# Altium project Orient.PrjPcb (part 5 of 6)

## Sheet Power_Regulation1.SchDoc
size A
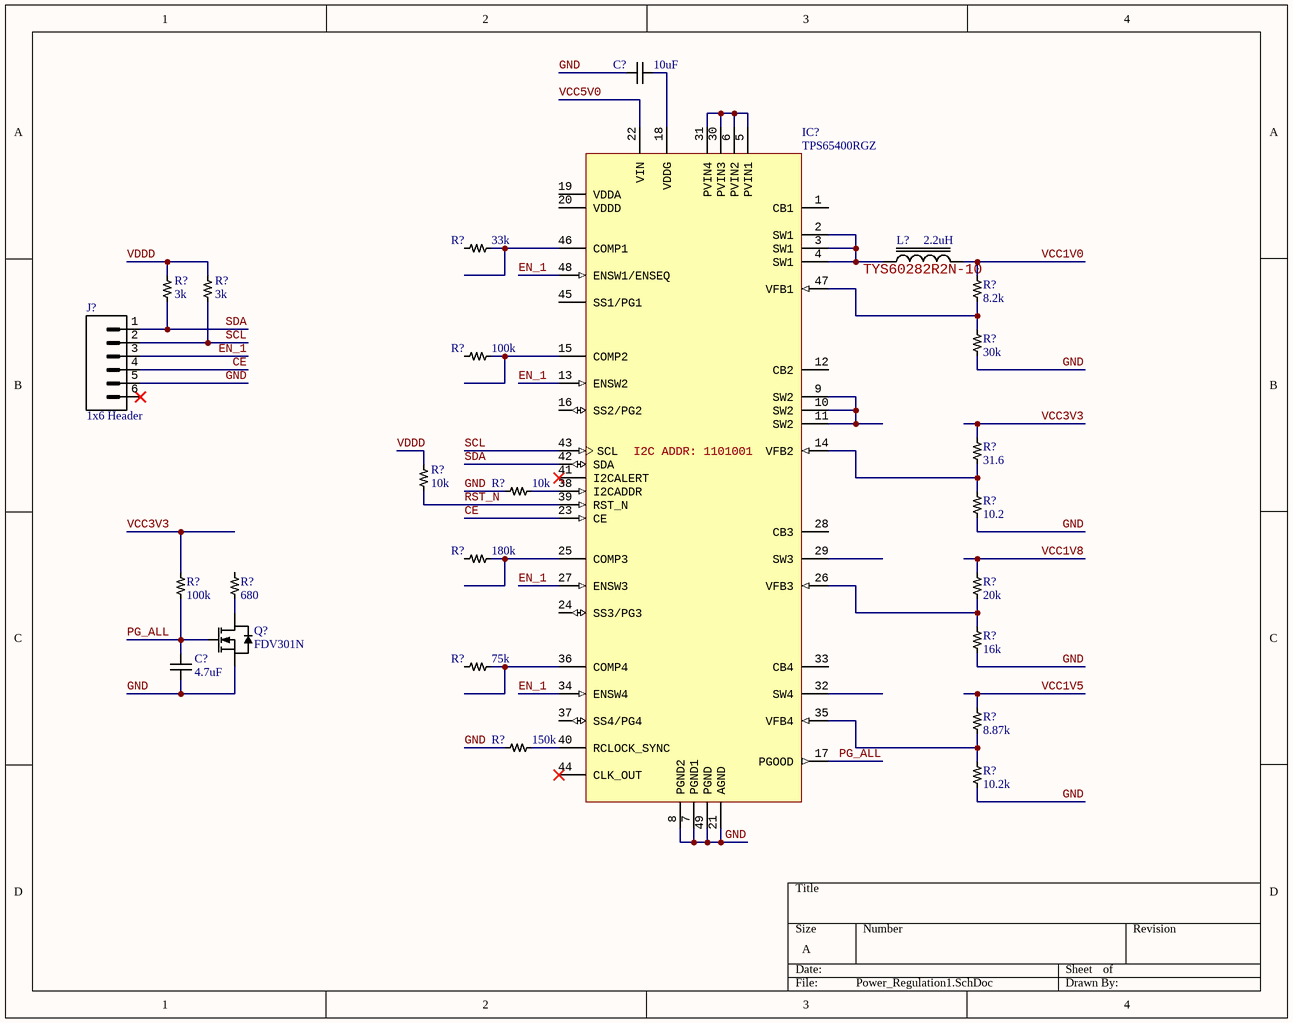
[diagram p9: Power_Regulation1.SchDoc]

### Parts
(Parts that share a designator on the sheet are numbered #1, #2 ... from top to bottom, then left to right.)
C?#91  10uF  [CAP0805]
C?#92  4.7uF  [CAP0805]
IC?#14  TPS65400RGZ  [QFN48]
J?#11  1x6 Header
L?  2.2uH
Q?#2  FDV301N  [SOT-23]
R?#137  33k  [RES0402]
R?#138  3k  [RES0402]
R?#139  3k  [RES0402]
R?#140  8.2k  [RES0402]
R?#141  30k  [RES0402]
R?#142  100k  [RES0402]
R?#143  31.6  [RES0402]
R?#144  10k  [RES0402]
R?#145  10k  [RES0402]
R?#146  10.2  [RES0402]
R?#147  180k  [RES0402]
R?#148  100k  [RES0402]
R?#149  680  [RES0402]
R?#150  20k  [RES0402]
R?#151  16k  [RES0402]
R?#152  75k  [RES0402]
R?#153  8.87k  [RES0402]
R?#154  150k  [RES0402]
R?#155  10.2k  [RES0402]

### Nets
GND: C?#91.2 C?#92.2 IC?#14.7(PGND1) IC?#14.8(PGND2) IC?#14.21(AGND) IC?#14.49(PGND) J?#11.5 Q?#2.2(S) R?#141.1 R?#145.1 R?#146.1 R?#151.1 R?#154.1 R?#155.1
CE: IC?#14.23(CE) J?#11.4
EN_1: IC?#14.13(ENSW2) IC?#14.27(ENSW3) IC?#14.34(ENSW4) IC?#14.48(ENSW1/ENSEQ) J?#11.3
PG_ALL: C?#92.1 IC?#14.17(PGOOD) Q?#2.1(G) R?#148.1
RST_N: IC?#14.39(RST_N) R?#144.1
SCL: IC?#14.43(SCL) J?#11.2 R?#139.1
SDA: IC?#14.42(SDA) J?#11.1 R?#138.1
VCC1V0: L?.2 R?#140.2
VCC1V5: R?#153.2
VCC1V8: R?#150.2
VCC3V3: R?#143.2 R?#148.2
VCC5V0: IC?#14.22(VIN)
VDDD: R?#138.2 R?#139.2 R?#144.2
NetC?#91_1: C?#91.1 IC?#14.18(VDDG)
NetIC?#14_2: IC?#14.2(SW1) IC?#14.3(SW1) IC?#14.4(SW1) L?.1
NetIC?#14_5: IC?#14.5(PVIN1) IC?#14.6(PVIN2) IC?#14.30(PVIN3) IC?#14.31(PVIN4)
NetIC?#14_9: IC?#14.9(SW2) IC?#14.10(SW2) IC?#14.11(SW2)
NetIC?#14_14: IC?#14.14(VFB2) R?#143.1 R?#146.2
NetIC?#14_15: IC?#14.15(COMP2) R?#142.2
NetIC?#14_25: IC?#14.25(COMP3) R?#147.2
NetIC?#14_26: IC?#14.26(VFB3) R?#150.1 R?#151.2
NetIC?#14_35: IC?#14.35(VFB4) R?#153.1 R?#155.2
NetIC?#14_36: IC?#14.36(COMP4) R?#152.2
NetIC?#14_38: IC?#14.38(I2CADDR) R?#145.2
NetIC?#14_40: IC?#14.40(RCLOCK_SYNC) R?#154.2
NetIC?#14_46: IC?#14.46(COMP1) R?#137.2
NetIC?#14_47: IC?#14.47(VFB1) R?#140.1 R?#141.2
NetQ?#2_3: Q?#2.3(D) R?#149.1

Not connected (* = marked no-connect by the designer): IC?#14 1(CB1) 12(CB2) 16(SS2/PG2) 19(VDDA) 20(VDDD) 24(SS3/PG3) 28(CB3) 29(SW3) 32(SW4) 33(CB4) 37(SS4/PG4) 41(I2CALERT)* 44(CLK_OUT)* 45(SS1/PG1); J?#11 6*; R?#137 1; R?#142 1; R?#147 1; R?#149 2; R?#152 1

### Notes on the sheet
- (in symbol TPS65400RGZ) I2C ADDR: 1101001

### Library data of the parts
C?#91 = 08056D106KAT2A: MLCC 10uF 0805 SMD; Manufacturer: Kyocera AVX; Dielectric Material: Ceramic; Voltage Rating: 6.3V; Tolerance: 10%; Dielectric: X5R; Insulation Resistance: 500MR; Supplier 1: Digi-Key; Manufacturer Part Number: 08056D106KAT2A; Stock 1: 217962; Pricing 1: 1=0.50000, 10=0.35100, 100=0.23100, 500=0.17112, 1000=0.14545 (USD); RoHS: Yes; Mount: Surface Mount,PCB; Case/Package: 0805; Number of Pins: 2; Case Code (Imperial): 0805; Case Code (Metric): 2012; Min Operating Temperature: -55°C; Max Operating Temperature: 85°C; Capacitance: 10uF; Package Quantity: 1; Voltage Rating (DC): 6.3V; Packaging: Tape and Reel; Termination: SMD/SMT; Voltage: 6.3V; Length: 2.01mm; Height: 1.4mm; Width: 1.25mm; Thickness: 0.055inch; Depth: 1.25mm; Radiation Hardening: No; REACH SVHC: No SVHC; Lead Free: Lead Free; ComponentLink1URL: https://datasheet.ciiva.com/11788/0900766b80def1a5-11788549.pdf?src-supplier=RSComponents; ComponentLink1Description: https://datasheet.ciiva.com/11788/0900766b80def1a5-11788549.pdf?src-supplier=RSComponents; ComponentLink2URL: https://datasheet.ciiva.com/19467/2012662-19467718.pdf?src-supplier=Jameco; ComponentLink2Description: https://datasheet.ciiva.com/19467/2012662-19467718.pdf?src-supplier=Jameco; ComponentLink3URL: https://datasheet.ciiva.com/151/cx5r-151672.pdf?src-supplier=Digi-Key; ComponentLink3Description: https://datasheet.ciiva.com/151/cx5r-151672.pdf?src-supplier=Digi-Key; ComponentLink4URL: https://datasheet.ciiva.com/7812/26587-7812184.pdf?src-supplier=Element14; ComponentLink4Description: https://datasheet.ciiva.com/7812/26587-7812184.pdf?src-supplier=Element14; ComponentLink5URL: https://datasheet.ciiva.com/14598/70001028-14598616.pdf?src-supplier=Allied+Electronics; ComponentLink5Description: https://datasheet.ciiva.com/14598/70001028-14598616.pdf?src-supplier=Allied+Electronics; ComponentLink6URL: https://datasheet.ciiva.com/151/cx5r-151673.pdf?src-supplier=Digi-Key; ComponentLink6Description: https://datasheet.ciiva.com/151/cx5r-151673.pdf?src-supplier=Digi-Key; ComponentLink7URL: https://datasheet.ciiva.com/7812/26587-7812185.pdf?src-supplier=Element14; ComponentLink7Description: https://datasheet.ciiva.com/7812/26587-7812185.pdf?src-supplier=Element14; ComponentLink8URL: https://datasheet.ciiva.com/151/cx5r-151674.pdf?src-supplier=Digi-Key; ComponentLink8Description: https://datasheet.ciiva.com/151/cx5r-151674.pdf?src-supplier=Digi-Key; ComponentLink9URL: https://datasheet.ciiva.com/7812/1666675-7812186.pdf?src-supplier=Element14; ComponentLink9Description: https://datasheet.ciiva.com/7812/1666675-7812186.pdf?src-supplier=Element14; ComponentLink10URL: https://datasheet.ciiva.com/2988/cx5r-2988044.pdf?src-supplier=Avnet; ComponentLink10Description: https://datasheet.ciiva.com/2988/cx5r-2988044.pdf?src-supplier=Avnet; ComponentLink11URL: https://datasheet.ciiva.com/16392/cx5r-16392797.pdf?src-supplier=Future+Electronics; ComponentLink11Description: https://datasheet.ciiva.com/16392/cx5r-16392797.pdf?src-supplier=Future+Electronics; ComponentLink12URL: https://datasheet.ciiva.com/16544/cx5r-16544062.pdf?src-supplier=Avnet+Asia; ComponentLink12Description: https://datasheet.ciiva.com/16544/cx5r-16544062.pdf?src-supplier=Avnet+Asia
C?#92 = C2012X7R1A475K085AC: MLCC 4.7uF 0805 SMD; Manufacturer: TDK; Dielectric Material: Ceramic; Tolerance: 10%; Voltage Rating: 10V; Dielectric: X7R; Supplier 1: Digi-Key; Manufacturer Part Number: C2012X7R1A475K085AC; Stock 1: 87407; Pricing 1: 1=0.22000, 10=0.15200, 100=0.08600, 500=0.06072, 1000=0.05313 (USD); RoHS: Yes; Mount: Surface Mount; Case/Package: 0805; Case Code (Metric): 2012; Case Code (Imperial): 0805; Min Operating Temperature: -55°C; Max Operating Temperature: 125°C; Package Quantity: 4000; Packaging: Cut Tape; Capacitance: 4.7uF; Voltage Rating (DC): 10V; Length: 0.079inch; Width: 0.049inch; Thickness: 0.039inch; REACH SVHC: No SVHC; Lead Free: Lead Free; ComponentLink1URL: https://datasheet.ciiva.com/14886/tdkmlcccaprange-14886121.pdf?src-supplier=Digi-Key; ComponentLink1Description: https://datasheet.ciiva.com/14886/tdkmlcccaprange-14886121.pdf?src-supplier=Digi-Key; ComponentLink2Description: https://product.tdk.com/info/en/catalog/datasheets/mlcc_commercial_general_en.pdf; ComponentLink2URL: https://product.tdk.com/info/en/catalog/datasheets/mlcc_commercial_general_en.pdf
IC?#14 = TPS65400RGZ: Flexible Power Management Unit with PMBus/I2C Interface, 4.5 to 18 V, -40 to 85 degC, 48-Pin VQFN (RGZ), Green (RoHS & no Sb/Br), Tape and Reel; Output Voltage: 0.6V; Pd - Power Dissipation: 4.5W; Topology: Buck; Input Voltage MIN: 4.5V; Operating Supply Current: 6.3mA; Switching Frequency: 2.2MHz; Brand: TexasInstruments; Input Voltage MAX: 18V; Number of Outputs: 4Output; Load Regulation: 0.1%/A; Output Current: 4A; Unit Weight: 0.004938oz; Input Voltage: 4.5Vto18V; RoHS: True; Datasheet URL: http://www.ti.com/lit/ds/symlink/tps65400.pdf; Height: 1mm; Package Description: 48-Pin Plastic Quad Flat No-lead Package, Body 7 x 7 mm, Pitch 0.5mm, Thermal Pad 4.08 x 4.08 mm; Product: SwitchingRegulators; Packaging: Reel; Operating Temperature Range: -40Cto+85C; Mounting Style: SMD/SMT; Maximum Operating Temperature: +85C; Minimum Operating Temperature: -40C; Length: 7.15mm; Factory Pack Quantity: 250; Width: 7.15mm; Package Reference: RGZ0048B; Mounting Technology: SurfaceMount; Datasheet Version: Rev. B, 09/2015; Manufacturer: TexasInstruments; Manufacturer URL: http://www.ti.com/; Type: SwitchingRegulator; Series: TPS65400; Shutdown: Shutdown; Product Category: VoltageRegulators-SwitchingRegulators; Package / Case: VQFN-48
J?#11 = PPTC061LFBN-RC: Header Female 1x6 2.54mm; Manufacturer: Sullins; Number of Positions: 6; Connector Type: Header,Socket; Pitch: 0.1inch; Supplier 1: Digi-Key; Manufacturer Part Number: PPTC061LFBN-RC; Stock 1: 13781; Pricing 1: 1=0.52000, 10=0.48300, 100=0.37050, 500=0.32220, 1000=0.26582, 5000=0.23360, 10000=0.23270 (USD); RoHS: Yes; Mount: Through Hole; Color: Black; Contact Plating: Tin; Contact Material: Bronze; Housing Material: Plastic; Package Quantity: 1000; Number of Rows: 1; Packaging: Bulk; Termination: Solder; Length: 15.7mm; Height: 8.5mm; Width: 2.5mm; Lead Free: Lead Free; ComponentLink1URL: https://media.digikey.com/pdf/Data%20Sheets/Sullins%20PDFs/Female_Headers.100_DS.pdf?src-supplier=Digi-Key; ComponentLink1Description: https://media.digikey.com/pdf/Data%20Sheets/Sullins%20PDFs/Female_Headers.100_DS.pdf?src-supplier=Digi-Key; ComponentLink2URL: http://www.sullinscorp.com/catalogs/78_Page80-81_HEADER_.100_2.54mm_FEMALE.pdf?src-supplier=Future+Electronics; ComponentLink2Description: http://www.sullinscorp.com/catalogs/78_Page80-81_HEADER_.100_2.54mm_FEMALE.pdf?src-supplier=Future+Electronics
L? = TYS60282R2N-10: Inductor 2.2uH; Manufacturer: Laird Steward; Tolerance: 30%; Current Rating: 3.75A; Saturation Current: 5.1A; Shielding: Shielded; DC Resistance (DCR): 20mR; Self Resonant Frequency: 48MHz; Test Frequency: 100kHz; Supplier 1: Digi-Key; Manufacturer Part Number: TYS60282R2N-10; Stock 1: 7309; Pricing 1: 1=0.67000, 10=0.58700, 100=0.41940, 500=0.35226, 1000=0.28516 (USD); RoHS: Yes; Mount: Surface Mount; Case/Package: Nonstandard; Min Operating Temperature: -40°C; Max Operating Temperature: 125°C; Package Quantity: 2000; Packaging: Tape and Reel; Inductance: 2.2uH; Max DC Current: 3.75A; Termination: SMD/SMT; Length: 0.236inch; Height: 2.8mm; Width: 0.236inch; Height - Seated (Max): 0.118inch; ComponentLink1URL: http://www.mouser.com/ds/2/223/SIP-DS-TYS%206028%200413-558563.pdf?src-supplier=Mouser; ComponentLink1Description: http://www.mouser.com/ds/2/223/SIP-DS-TYS%206028%200413-558563.pdf?src-supplier=Mouser; ComponentLink3URL: https://assets.lairdtech.com/home/brandworld/files/Catalog_Power%20Inductor%20TYS%20SERIES%200617.pdf?src-supplier=Digi-Key; ComponentLink3Description: https://assets.lairdtech.com/home/brandworld/files/Catalog_Power%20Inductor%20TYS%20SERIES%200617.pdf?src-supplier=Digi-Key
Q?#2 = FDV301N: Digital FET, N-Channel, 0.35 W, 25 V, -55 to 150 degC, 3-Pin SOT23, RoHS, Tape and Reel; Manufacturer: Fairchild; Rds(on) Test Voltage Vgs: 2.7V; Threshold Voltage Vgs Typ: 850mV; Voltage Vds Typ: 25V; Reel Quantity: 3000; Voltage Vgs Rds on Measurement: 4.5V; Power Dissipation Pd: 350mW; Continuous Drain Current Id: 220mA; Transistor Polarity: NChannel; No. of Transistors: 1; Package Version: Rev. 12, 03/2016; Voltage Vgs th Max: 1.5V; ESD HBM: 6kV; Pulse Current Idm: 500mA; Current Temperature: 25degC; On Resistance Rds(on): 5ohm; External Depth: 2.5mm; SMD Marking: 301; No. of Pins: 3; External Width: 3.05mm; SVHC: NoSVHC(19-Dec-2012); External Length / Height: 1.12mm; Termination Type: SMD; Transistor Case Style: SOT-23; Package Reference: SOT23-3; Package URL: http://www.fairchildsemi.com/dwg/MA/MA03D.pdf; Voltage Vgs Max: 850mV; Drain Source Voltage Vds: 25V; Operating Temperature Max: 150degC; Package Description: 3-Pin Small Outline Transistor, Body 2.92 x 1.325 mm, Pitch 0.95 mm; Operating Temperature Min: -55degC; Datasheet Version: Jun-09; Tape Width: 8mm; Full Power Rating Temperature: 25degC; Datasheet URL: https://datasheet.ciiva.com/8114/fdv301n-8114688.pdf; Package / Case: SOT-23; Manufacturer URL: https://www.fairchildsemi.com/; Current Id Max: 220mA; Operating Temperature Range: -55degCto+150degC
R?#137 = RC0402FR-0733KL: Resistor 33kOhm 0402 SMD; Manufacturer: Yageo; Tolerance: 1%; Resistance: 33kR; Power Rating: 63mW; Temperature Coefficient: 100ppm/°C; Voltage Rating: 50V; Supplier 1: Digi-Key; Manufacturer Part Number: RC0402FR-0733KL; Stock 1: 1570814; Pricing 1: 1=0.10000, 10=0.01600, 100=0.00670, 1000=0.00301, 2500=0.00261, 5000=0.00215 (USD); RoHS: Yes; Case/Package: 0402; Number of Pins: 2; Weight: 2.3E-05oz; Case Code (Metric): 1005; Case Code (Imperial): 0402; Min Operating Temperature: -55°C; Max Operating Temperature: 155°C; Packaging: Tape and Reel; Package Quantity: 1; Voltage Rating (DC): 50V; Composition: Thick Film; Number of Terminations: 2; Termination: SMD/SMT; Military Standard: Not; Max Power Dissipation: 63mW; Features: Moisture Resistant; Length: 1mm; Height: 0.016inch; Depth: 0.5mm; Width: 0.5mm; REACH SVHC: No SVHC; Lead Free: Lead Free; ComponentLink1URL: https://datasheet.ciiva.com/2453/pyu-r-int-thick-7-2453448.pdf?src-supplier=Digi-Key; ComponentLink1Description: https://datasheet.ciiva.com/2453/pyu-r-int-thick-7-2453448.pdf?src-supplier=Digi-Key; ComponentLink2URL: https://datasheet.ciiva.com/2453/pyu-r-int-thick-7-2453449.pdf?src-supplier=Digi-Key; ComponentLink2Description: https://datasheet.ciiva.com/2453/pyu-r-int-thick-7-2453449.pdf?src-supplier=Digi-Key; ComponentLink3URL: https://datasheet.ciiva.com/12577/pyu-rc0402-51-rohs-l-6-r-12577273.pdf?src-supplier=Mouser; ComponentLink3Description: https://datasheet.ciiva.com/12577/pyu-rc0402-51-rohs-l-6-r-12577273.pdf?src-supplier=Mouser; ComponentLink4URL: https://datasheet.ciiva.com/2453/pyu-r-int-thick-7-2453450.pdf?src-supplier=Digi-Key; ComponentLink4Description: https://datasheet.ciiva.com/2453/pyu-r-int-thick-7-2453450.pdf?src-supplier=Digi-Key; ComponentLink5URL: https://datasheet.ciiva.com/7849/1018594-7849964.pdf?src-supplier=Element14; ComponentLink5Description: https://datasheet.ciiva.com/7849/1018594-7849964.pdf?src-supplier=Element14; ComponentLink6URL: https://datasheet.ciiva.com/7849/1018594-7849965.pdf?src-supplier=Element14; ComponentLink6Description: https://datasheet.ciiva.com/7849/1018594-7849965.pdf?src-supplier=Element14
R?#138 R?#139 = RC0402FR-073KL: Resistor 3kOhm 0402 SMD; Manufacturer: Yageo; Tolerance: 1%; Resistance: 3kR; Power Rating: 63mW; Voltage Rating: 50V; Temperature Coefficient: 100ppm/°C; Supplier 1: Digi-Key; Manufacturer Part Number: RC0402FR-073KL; Stock 1: 1790568; Pricing 1: 1=0.10000, 10=0.01600, 100=0.00670, 1000=0.00301, 2500=0.00261, 5000=0.00215 (USD); RoHS: Yes; Case/Package: 0402; Case Code (Metric): 1005; Case Code (Imperial): 0402; Min Operating Temperature: -55°C; Max Operating Temperature: 155°C; Package Quantity: 1; Packaging: Tape and Reel; Composition: Thick Film; Number of Terminations: 2; Termination: SMD/SMT; Military Standard: Not; Max Power Dissipation: 63mW; Voltage Rating (DC): 50V; Features: Moisture Resistant; Length: 1mm; Height: 0.016inch; Width: 0.02inch; Depth: 0.5mm; REACH SVHC: Unknown; Lead Free: Lead Free; ComponentLink1URL: https://datasheet.ciiva.com/2553/pyu-r-int-thick-7-2553255.pdf?src-supplier=Digi-Key; ComponentLink1Description: https://datasheet.ciiva.com/2553/pyu-r-int-thick-7-2553255.pdf?src-supplier=Digi-Key; ComponentLink2URL: https://datasheet.ciiva.com/2553/pyu-r-int-thick-7-2553256.pdf?src-supplier=Digi-Key; ComponentLink2Description: https://datasheet.ciiva.com/2553/pyu-r-int-thick-7-2553256.pdf?src-supplier=Digi-Key; ComponentLink3URL: https://datasheet.ciiva.com/7849/1018594-7849992.pdf?src-supplier=Element14; ComponentLink3Description: https://datasheet.ciiva.com/7849/1018594-7849992.pdf?src-supplier=Element14; ComponentLink4URL: https://datasheet.ciiva.com/2553/pyu-r-int-thick-7-2553254.pdf?src-supplier=Digi-Key; ComponentLink4Description: https://datasheet.ciiva.com/2553/pyu-r-int-thick-7-2553254.pdf?src-supplier=Digi-Key; ComponentLink5URL: https://datasheet.ciiva.com/7849/1018594-7849991.pdf?src-supplier=Element14; ComponentLink5Description: https://datasheet.ciiva.com/7849/1018594-7849991.pdf?src-supplier=Element14; ComponentLink6URL: https://datasheet.ciiva.com/12666/pyu-rc0402-51-rohs-l-6-r-12666952.pdf?src-supplier=Mouser; ComponentLink6Description: https://datasheet.ciiva.com/12666/pyu-rc0402-51-rohs-l-6-r-12666952.pdf?src-supplier=Mouser
R?#140 = RC0402FR-078K2L: Resistor 8.2kOhm 0402 SMD; Manufacturer: Yageo; Resistance: 8.2kR; Power Rating: 63mW; Tolerance: 1%; Voltage Rating: 50V; Temperature Coefficient: 100ppm/°C; Supplier 1: Digi-Key; Manufacturer Part Number: RC0402FR-078K2L; Stock 1: 4299157; Pricing 1: 1=0.10000, 10=0.01600, 100=0.00670, 1000=0.00301, 2500=0.00261, 5000=0.00215 (USD); RoHS: Yes; Case/Package: 0402; Weight: 2.3E-05oz; Case Code (Metric): 1005; Case Code (Imperial): 0402; Min Operating Temperature: -55°C; Max Operating Temperature: 155°C; Package Quantity: 1; Packaging: Tape and Reel; Composition: Thick Film; Number of Terminations: 2; Termination: SMD/SMT; Military Standard: Not; Max Power Dissipation: 63mW; Working Voltage: 50V; Features: Moisture Resistant; Length: 1mm; Height: 0.016inch; Width: 0.02inch; Depth: 0.5mm; REACH SVHC: Unknown; Lead Free: Lead Free; ComponentLink1URL: https://datasheet.ciiva.com/2519/pyu-r-int-thick-7-2519060.pdf?src-supplier=Digi-Key; ComponentLink1Description: https://datasheet.ciiva.com/2519/pyu-r-int-thick-7-2519060.pdf?src-supplier=Digi-Key; ComponentLink2URL: https://datasheet.ciiva.com/2519/pyu-r-int-thick-7-2519061.pdf?src-supplier=Digi-Key; ComponentLink2Description: https://datasheet.ciiva.com/2519/pyu-r-int-thick-7-2519061.pdf?src-supplier=Digi-Key; ComponentLink3URL: https://datasheet.ciiva.com/2519/pyu-r-int-thick-7-2519062.pdf?src-supplier=Digi-Key; ComponentLink3Description: https://datasheet.ciiva.com/2519/pyu-r-int-thick-7-2519062.pdf?src-supplier=Digi-Key; ComponentLink4URL: https://datasheet.ciiva.com/12577/pyu-rc0402-51-rohs-l-6-r-12577260.pdf?src-supplier=Mouser; ComponentLink4Description: https://datasheet.ciiva.com/12577/pyu-rc0402-51-rohs-l-6-r-12577260.pdf?src-supplier=Mouser; ComponentLink5URL: https://datasheet.ciiva.com/16741/pyu-rc0402-51-rohs-l-6-r-16741020.pdf?src-supplier=Future+Electronics; ComponentLink5Description: https://datasheet.ciiva.com/16741/pyu-rc0402-51-rohs-l-6-r-16741020.pdf?src-supplier=Future+Electronics; ComponentLink6URL: https://datasheet.ciiva.com/7850/1018594-7850109.pdf?src-supplier=Element14; ComponentLink6Description: https://datasheet.ciiva.com/7850/1018594-7850109.pdf?src-supplier=Element14; ComponentLink7URL: https://datasheet.ciiva.com/15189/getdatasheetpartid-329193-15189517.pdf?src-supplier=Verical; ComponentLink7Description: https://datasheet.ciiva.com/15189/getdatasheetpartid-329193-15189517.pdf?src-supplier=Verical; ComponentLink8URL: https://datasheet.ciiva.com/7850/1018594-7850110.pdf?src-supplier=Element14; ComponentLink8Description: https://datasheet.ciiva.com/7850/1018594-7850110.pdf?src-supplier=Element14
R?#141 = RC0402FR-0730KL: Resistor 30kOhm 0402 SMD; Manufacturer: Yageo; Tolerance: 1%; Resistance: 30kR; Power Rating: 62.5mW; Voltage Rating: 50V; Temperature Coefficient: 100ppm/°C; Supplier 1: Digi-Key; Manufacturer Part Number: RC0402FR-0730KL; Stock 1: 1533780; Pricing 1: 1=0.10000, 10=0.01600, 100=0.00670, 1000=0.00301, 2500=0.00261, 5000=0.00215 (USD); RoHS: Yes; Case/Package: 0402; Weight: 2.3E-05oz; Case Code (Imperial): 0402; Case Code (Metric): 1005; Min Operating Temperature: -55°C; Max Operating Temperature: 155°C; Packaging: Tape and Reel; Termination: SMD/SMT; Composition: Thick Film; Military Standard: Not; Voltage Rating (DC): 50V; Length: 1mm; Height: 0.35mm; Width: 0.5mm; Depth: 0.5mm; REACH SVHC: Unknown; Lead Free: Lead Free; ComponentLink1URL: https://datasheet.ciiva.com/12577/pyu-rc0402-51-rohs-l-6-r-12577743.pdf?src-supplier=Mouser; ComponentLink1Description: https://datasheet.ciiva.com/12577/pyu-rc0402-51-rohs-l-6-r-12577743.pdf?src-supplier=Mouser; ComponentLink2URL: https://datasheet.ciiva.com/7849/1018594-7849957.pdf?src-supplier=Element14; ComponentLink2Description: https://datasheet.ciiva.com/7849/1018594-7849957.pdf?src-supplier=Element14; ComponentLink3URL: https://datasheet.ciiva.com/46394/1018594-46394938.pdf?src-supplier=Element14; ComponentLink3Description: https://datasheet.ciiva.com/46394/1018594-46394938.pdf?src-supplier=Element14
R?#142 R?#148 = RC0402FR-07100KL: Resistor 100kOhm 0402 SMD; Manufacturer: Yageo; Tolerance: 1%; Resistance: 100kR; Temperature Coefficient: 100ppm/°C; Power Rating: 63mW; Voltage Rating: 50V; Supplier 1: Digi-Key; Manufacturer Part Number: RC0402FR-07100KL; Stock 1: 55225580; Pricing 1: 1=0.10000, 10=0.01500, 100=0.00630, 1000=0.00281, 2500=0.00244, 5000=0.00201 (USD); RoHS: Yes; Case/Package: 0402; Case Code (Metric): 1005; Case Code (Imperial): 0402; Min Operating Temperature: -55°C; Max Operating Temperature: 155°C; Composition: Thick Film; Packaging: Tape and Reel; Package Quantity: 1; Number of Terminations: 2; Termination: SMD/SMT; Military Standard: Not; Max Power Dissipation: 63mW; Working Voltage: 50V; Features: Moisture Resistant; Length: 0.039inch; Height: 0.016inch; Width: 0.02inch; Depth: 0.5mm; REACH SVHC: No SVHC; Lead Free: Lead Free; ComponentLink1URL: https://datasheet.ciiva.com/11819/0900766b80c66297-11819452.pdf?src-supplier=RSComponents; ComponentLink1Description: https://datasheet.ciiva.com/11819/0900766b80c66297-11819452.pdf?src-supplier=RSComponents; ComponentLink2URL: https://datasheet.ciiva.com/2453/pyu-r-int-thick-7-2453361.pdf?src-supplier=Digi-Key; ComponentLink2Description: https://datasheet.ciiva.com/2453/pyu-r-int-thick-7-2453361.pdf?src-supplier=Digi-Key; ComponentLink3URL: https://datasheet.ciiva.com/2453/pyu-r-int-thick-7-2453362.pdf?src-supplier=Digi-Key; ComponentLink3Description: https://datasheet.ciiva.com/2453/pyu-r-int-thick-7-2453362.pdf?src-supplier=Digi-Key; ComponentLink4URL: https://datasheet.ciiva.com/2453/pyu-r-int-thick-7-2453363.pdf?src-supplier=Digi-Key; ComponentLink4Description: https://datasheet.ciiva.com/2453/pyu-r-int-thick-7-2453363.pdf?src-supplier=Digi-Key; ComponentLink5URL: https://datasheet.ciiva.com/22747/1018594-22747509.pdf?src-supplier=Element14; ComponentLink5Description: https://datasheet.ciiva.com/22747/1018594-22747509.pdf?src-supplier=Element14; ComponentLink6URL: https://datasheet.ciiva.com/15189/getdatasheetpartid-323696-15189334.pdf?src-supplier=Verical; ComponentLink6Description: https://datasheet.ciiva.com/15189/getdatasheetpartid-323696-15189334.pdf?src-supplier=Verical; ComponentLink7URL: https://datasheet.ciiva.com/12667/pyu-rc0402-51-rohs-l-6-r-12667930.pdf?src-supplier=Mouser; ComponentLink7Description: https://datasheet.ciiva.com/12667/pyu-rc0402-51-rohs-l-6-r-12667930.pdf?src-supplier=Mouser
R?#143 = RC0402FR-0731R6L: POWER Resistor 31.6Ohm 0402 SMD; Manufacturer: Yageo; Power Rating: 62.5mW; Resistance: 31.6R; Tolerance: 1%; Voltage Rating: 50V; Temperature Coefficient: 100ppm/°C; Max Power Dissipation: 63mW; Supplier 1: Digi-Key; Manufacturer Part Number: RC0402FR-0731R6L; Stock 1: 405052; Pricing 1: 1=0.10000, 10=0.01600, 100=0.00670, 1000=0.00301, 2500=0.00261, 5000=0.00215 (USD); RoHS: Yes; Case/Package: 0402; Case Code (Imperial): 0402; Case Code (Metric): 1005; Min Operating Temperature: -55°C; Max Operating Temperature: 155°C; Packaging: Tape and Reel; Composition: Thick Film; Termination: SMD/SMT; Number of Terminations: 2; Military Standard: Not; Voltage Rating (DC): 50V; Features: Moisture Resistant; Length: 1mm; Height: 0.016inch; Width: 0.5mm; Depth: 0.5mm; Lead Free: Lead Free; ComponentLink1URL: https://datasheet.ciiva.com/17423/pyu-rc0402-51-rohs-l-6-r-17423865.pdf?src-supplier=Future+Electronics; ComponentLink1Description: https://datasheet.ciiva.com/17423/pyu-rc0402-51-rohs-l-6-r-17423865.pdf?src-supplier=Future+Electronics
R?#144 R?#145 = RC0402FR-0710KL: Resistor 10kOhm 0402 SMD; Manufacturer: Yageo; Resistance: 10kR; Tolerance: 1%; Temperature Coefficient: 100ppm/°C; Voltage Rating: 50V; Power Rating: 62.5mW; Supplier 1: Digi-Key; Manufacturer Part Number: RC0402FR-0710KL; Stock 1: 78932647; Pricing 1: 1=0.10000, 10=0.01500, 100=0.00630, 1000=0.00281, 2500=0.00244, 5000=0.00201 (USD); RoHS: Yes; Case/Package: 0402; Number of Pins: 2; Case Code (Imperial): 0402; Case Code (Metric): 1005; Min Operating Temperature: -55°C; Max Operating Temperature: 155°C; Packaging: Tape and Reel; Composition: Thick Film; Voltage Rating (DC): 50V; Termination: SMD/SMT; Military Standard: Not; Working Voltage: 50V; Number of Terminations: 2; Length: 1mm; Height: 0.32mm; Width: 0.5mm; Depth: 0.5mm; Lead Pitch: 0.2mm; REACH SVHC: No SVHC; Lead Free: Lead Free; ComponentLink1URL: https://datasheet.ciiva.com/7660/38568-7660787.pdf?src-supplier=Element14; ComponentLink1Description: https://datasheet.ciiva.com/7660/38568-7660787.pdf?src-supplier=Element14; ComponentLink2URL: https://datasheet.ciiva.com/7983/1018594-7983486.pdf?src-supplier=Element14; ComponentLink2Description: https://datasheet.ciiva.com/7983/1018594-7983486.pdf?src-supplier=Element14; ComponentLink3URL: https://datasheet.ciiva.com/7849/1784430-7849813.pdf?src-supplier=Element14; ComponentLink3Description: https://datasheet.ciiva.com/7849/1784430-7849813.pdf?src-supplier=Element14; ComponentLink4URL: https://datasheet.ciiva.com/7849/1686128-7849814.pdf?src-supplier=Element14; ComponentLink4Description: https://datasheet.ciiva.com/7849/1686128-7849814.pdf?src-supplier=Element14; ComponentLink5URL: https://datasheet.ciiva.com/7849/1784430-7849815.pdf?src-supplier=Element14; ComponentLink5Description: https://datasheet.ciiva.com/7849/1784430-7849815.pdf?src-supplier=Element14; ComponentLink6URL: https://datasheet.ciiva.com/22747/1018594-22747512.pdf?src-supplier=Element14; ComponentLink6Description: https://datasheet.ciiva.com/22747/1018594-22747512.pdf?src-supplier=Element14; ComponentLink7URL: https://datasheet.ciiva.com/12667/pyu-rc0402-51-rohs-l-6-r-12667067.pdf?src-supplier=Mouser; ComponentLink7Description: https://datasheet.ciiva.com/12667/pyu-rc0402-51-rohs-l-6-r-12667067.pdf?src-supplier=Mouser
R?#146 = RC0402FR-0710R2L: Resistor 10.2Ohm 0402 SMD; Manufacturer: Yageo; Resistance: 10.2R; Tolerance: 1%; Temperature Coefficient: 100ppm/°C; Power Rating: 62.5mW; Voltage Rating: 50V; Max Power Dissipation: 63mW; Supplier 1: Digi-Key; Manufacturer Part Number: RC0402FR-0710R2L; Stock 1: 15931; Pricing 1: 1=0.10000, 10=0.01600, 100=0.00670, 1000=0.00301, 2500=0.00261, 5000=0.00215 (USD); RoHS: Yes; Case/Package: 0402; Contact Plating: Tin,Matte; Case Code (Imperial): 0402; Case Code (Metric): 1005; Min Operating Temperature: -55°C; Max Operating Temperature: 155°C; Composition: Thick Film; Packaging: Tape and Reel; Termination: SMD/SMT; Number of Terminations: 2; Military Standard: Not; Voltage Rating (DC): 50V; Features: Moisture Resistant; Length: 1mm; Height: 0.016inch; Width: 0.5mm; Depth: 0.5mm; Lead Free: Lead Free; ComponentLink1URL: https://datasheet.ciiva.com/16869/pyu-rc0402-51-rohs-l-6-16869613.pdf?src-supplier=Avnet+Europe; ComponentLink1Description: https://datasheet.ciiva.com/16869/pyu-rc0402-51-rohs-l-6-16869613.pdf?src-supplier=Avnet+Europe; ComponentLink2URL: https://datasheet.ciiva.com/8891/pyu-rc0402-51-rohs-l-6-8891246.pdf?src-supplier=Avnet; ComponentLink2Description: https://datasheet.ciiva.com/8891/pyu-rc0402-51-rohs-l-6-8891246.pdf?src-supplier=Avnet; ComponentLink3URL: https://datasheet.ciiva.com/28405/pyu-rc0402-51-rohs-l-6-28405406.pdf?src-supplier=Avnet+Europe; ComponentLink3Description: https://datasheet.ciiva.com/28405/pyu-rc0402-51-rohs-l-6-28405406.pdf?src-supplier=Avnet+Europe
R?#147 = RC0402FR-07180KL: Resistor 180kOhm 0402 SMD; Manufacturer: Yageo; Tolerance: 1%; Power Rating: 63mW; Temperature Coefficient: 100ppm/°C; Resistance: 180kR; Voltage Rating: 50V; Supplier 1: Digi-Key; Manufacturer Part Number: RC0402FR-07180KL; Stock 1: 2802128; Pricing 1: 1=0.10000, 10=0.01600, 100=0.00670, 1000=0.00301, 2500=0.00261, 5000=0.00215 (USD); RoHS: Yes; Case/Package: Molded; Case Code (Imperial): 0402; Case Code (Metric): 1005; Min Operating Temperature: -55°C; Max Operating Temperature: 155°C; Packaging: Tape and Reel; Termination: SMD/SMT; Military Standard: Not; Composition: Thick Film; Length: 1mm; Depth: 0.5mm; REACH SVHC: Unknown; Lead Free: Lead Free; ComponentLink1URL: https://datasheet.ciiva.com/7983/1018594-7983497.pdf?src-supplier=Element14; ComponentLink1Description: https://datasheet.ciiva.com/7983/1018594-7983497.pdf?src-supplier=Element14; ComponentLink2URL: https://datasheet.ciiva.com/7849/1018594-7849851.pdf?src-supplier=Element14; ComponentLink2Description: https://datasheet.ciiva.com/7849/1018594-7849851.pdf?src-supplier=Element14; ComponentLink3URL: https://datasheet.ciiva.com/7849/1018594-7849852.pdf?src-supplier=Element14; ComponentLink3Description: https://datasheet.ciiva.com/7849/1018594-7849852.pdf?src-supplier=Element14; ComponentLink4URL: https://datasheet.ciiva.com/17025/pyu-rc0402-51-rohs-l-6-r-17025693.pdf?src-supplier=Future+Electronics; ComponentLink4Description: https://datasheet.ciiva.com/17025/pyu-rc0402-51-rohs-l-6-r-17025693.pdf?src-supplier=Future+Electronics; ComponentLink5URL: https://datasheet.ciiva.com/12656/pyu-rc0402-51-rohs-l-6-r-12656911.pdf?src-supplier=Mouser; ComponentLink5Description: https://datasheet.ciiva.com/12656/pyu-rc0402-51-rohs-l-6-r-12656911.pdf?src-supplier=Mouser
R?#149 = RC0402FR-07680RL: Resistor 680Ohm 0402 SMD; Manufacturer: Yageo; Resistance: 680R; Tolerance: 1%; Temperature Coefficient: 100ppm/°C; Power Rating: 63mW; Voltage Rating: 50V; Supplier 1: Digi-Key; Manufacturer Part Number: RC0402FR-07680RL; Stock 1: 1052750; Pricing 1: 1=0.10000, 10=0.01600, 100=0.00670, 1000=0.00301, 2500=0.00261, 5000=0.00215 (USD); RoHS: Yes; Case/Package: 0402; Case Code (Imperial): 0402; Case Code (Metric): 1005; Min Operating Temperature: -55°C; Max Operating Temperature: 155°C; Composition: Thick Film; Packaging: Tape and Reel; Termination: SMD/SMT; Military Standard: Not; Length: 1mm; Depth: 0.5mm; REACH SVHC: No SVHC; Lead Free: Lead Free; ComponentLink1URL: https://datasheet.ciiva.com/7850/1018594-7850070.pdf?src-supplier=Element14; ComponentLink1Description: https://datasheet.ciiva.com/7850/1018594-7850070.pdf?src-supplier=Element14; ComponentLink2URL: https://datasheet.ciiva.com/7850/1018594-7850071.pdf?src-supplier=Element14; ComponentLink2Description: https://datasheet.ciiva.com/7850/1018594-7850071.pdf?src-supplier=Element14; ComponentLink3URL: https://datasheet.ciiva.com/12667/pyu-rc0402-51-rohs-l-6-r-12667916.pdf?src-supplier=Mouser; ComponentLink3Description: https://datasheet.ciiva.com/12667/pyu-rc0402-51-rohs-l-6-r-12667916.pdf?src-supplier=Mouser; ComponentLink4URL: https://datasheet.ciiva.com/17042/pyu-rc0402-51-rohs-l-6-r-17042399.pdf?src-supplier=Future+Electronics; ComponentLink4Description: https://datasheet.ciiva.com/17042/pyu-rc0402-51-rohs-l-6-r-17042399.pdf?src-supplier=Future+Electronics
R?#150 = RC0402FR-0720KL: Resistor 20kOhm 0402 SMD; Manufacturer: Yageo; Tolerance: 1%; Resistance: 20kR; Power Rating: 62.5mW; Voltage Rating: 50V; Temperature Coefficient: 100ppm/°C; Max Power Dissipation: 63mW; Supplier 1: Digi-Key; Manufacturer Part Number: RC0402FR-0720KL; Stock 1: 5271703; Pricing 1: 1=0.10000, 10=0.01600, 100=0.00670, 1000=0.00301, 2500=0.00261, 5000=0.00215 (USD); RoHS: Yes; Case/Package: 0402; Number of Pins: 2; Case Code (Metric): 1005; Case Code (Imperial): 0402; Min Operating Temperature: -55°C; Max Operating Temperature: 155°C; Package Quantity: 1; Packaging: Tape and Reel; Composition: Thick Film; Number of Terminations: 2; Termination: SMD/SMT; Military Standard: Not; Voltage Rating (DC): 50V; Features: Moisture Resistant; Length: 1mm; Height: 0.016inch; Width: 0.02inch; Depth: 0.5mm; REACH SVHC: No SVHC; Lead Free: Lead Free; ComponentLink1URL: https://datasheet.ciiva.com/11808/0900766b80c66297-11808454.pdf?src-supplier=RSComponents; ComponentLink1Description: https://datasheet.ciiva.com/11808/0900766b80c66297-11808454.pdf?src-supplier=RSComponents; ComponentLink2URL: https://datasheet.ciiva.com/2453/pyu-r-int-thick-7-2453493.pdf?src-supplier=Digi-Key; ComponentLink2Description: https://datasheet.ciiva.com/2453/pyu-r-int-thick-7-2453493.pdf?src-supplier=Digi-Key; ComponentLink3URL: https://datasheet.ciiva.com/2453/pyu-r-int-thick-7-2453494.pdf?src-supplier=Digi-Key; ComponentLink3Description: https://datasheet.ciiva.com/2453/pyu-r-int-thick-7-2453494.pdf?src-supplier=Digi-Key; ComponentLink4URL: https://datasheet.ciiva.com/2453/pyu-r-int-thick-7-2453495.pdf?src-supplier=Digi-Key; ComponentLink4Description: https://datasheet.ciiva.com/2453/pyu-r-int-thick-7-2453495.pdf?src-supplier=Digi-Key; ComponentLink5URL: https://datasheet.ciiva.com/7983/1018594-7983511.pdf?src-supplier=Element14; ComponentLink5Description: https://datasheet.ciiva.com/7983/1018594-7983511.pdf?src-supplier=Element14; ComponentLink6URL: https://datasheet.ciiva.com/12558/pyu-rc0402-51-rohs-l-6-r-8721-12558796.pdf?src-supplier=Mouser; ComponentLink6Description: https://datasheet.ciiva.com/12558/pyu-rc0402-51-rohs-l-6-r-8721-12558796.pdf?src-supplier=Mouser; ComponentLink7URL: https://datasheet.ciiva.com/46394/1018594-46394974.pdf?src-supplier=Element14; ComponentLink7Description: https://datasheet.ciiva.com/46394/1018594-46394974.pdf?src-supplier=Element14
R?#151 = RC0402FR-0716KL: Resistor 16kOhm 0402 SMD; Manufacturer: Yageo; Voltage Rating: 50V; Tolerance: 1%; Power Rating: 63mW; Resistance: 16kR; Temperature Coefficient: 100ppm/°C; Supplier 1: Digi-Key; Manufacturer Part Number: RC0402FR-0716KL; Stock 1: 911180; Pricing 1: 1=0.10000, 10=0.01600, 100=0.00670, 1000=0.00301, 2500=0.00261, 5000=0.00215 (USD); RoHS: Yes; Case/Package: 0402; Case Code (Imperial): 0402; Case Code (Metric): 1005; Min Operating Temperature: -55°C; Max Operating Temperature: 155°C; Packaging: Tape and Reel; Termination: SMD/SMT; Composition: Thick Film; Military Standard: Not; Voltage Rating (DC): 50V; Length: 1mm; Height: 0.35mm; Width: 0.5mm; Depth: 0.5mm; REACH SVHC: Unknown; Lead Free: Lead Free; ComponentLink1URL: https://datasheet.ciiva.com/11808/0900766b80c66297-11808419.pdf?src-supplier=RSComponents; ComponentLink1Description: https://datasheet.ciiva.com/11808/0900766b80c66297-11808419.pdf?src-supplier=RSComponents; ComponentLink2URL: https://datasheet.ciiva.com/7849/1018594-7849847.pdf?src-supplier=Element14; ComponentLink2Description: https://datasheet.ciiva.com/7849/1018594-7849847.pdf?src-supplier=Element14; ComponentLink3URL: https://datasheet.ciiva.com/7849/1018594-7849848.pdf?src-supplier=Element14; ComponentLink3Description: https://datasheet.ciiva.com/7849/1018594-7849848.pdf?src-supplier=Element14; ComponentLink4URL: https://datasheet.ciiva.com/17423/pyu-rc0402-51-rohs-l-6-r-17423975.pdf?src-supplier=Future+Electronics; ComponentLink4Description: https://datasheet.ciiva.com/17423/pyu-rc0402-51-rohs-l-6-r-17423975.pdf?src-supplier=Future+Electronics
R?#152 = RC0402FR-0775KL: Resistor 75kOhm 0402 SMD; Manufacturer: Yageo; Resistance: 75kR; Tolerance: 1%; Power Rating: 62.5mW; Voltage Rating: 50V; Temperature Coefficient: 100ppm/°C; Max Power Dissipation: 63mW; Supplier 1: Digi-Key; Manufacturer Part Number: RC0402FR-0775KL; Stock 1: 932268; Pricing 1: 1=0.10000, 10=0.01600, 100=0.00670, 1000=0.00301, 2500=0.00261, 5000=0.00215 (USD); RoHS: Yes; Case/Package: 0402; Case Code (Metric): 1005; Case Code (Imperial): 0402; Min Operating Temperature: -55°C; Max Operating Temperature: 155°C; Packaging: Tape and Reel; Package Quantity: 1; Composition: Thick Film; Number of Terminations: 2; Termination: SMD/SMT; Military Standard: Not; Voltage Rating (DC): 50V; Features: Moisture Resistant; Length: 1mm; Height: 0.016inch; Width: 0.02inch; Depth: 0.5mm; REACH SVHC: No SVHC; Lead Free: Lead Free; ComponentLink1URL: https://datasheet.ciiva.com/11808/0900766b80c66297-11808837.pdf?src-supplier=RSComponents; ComponentLink1Description: https://datasheet.ciiva.com/11808/0900766b80c66297-11808837.pdf?src-supplier=RSComponents; ComponentLink2URL: https://datasheet.ciiva.com/2553/pyu-r-int-thick-7-2553239.pdf?src-supplier=Digi-Key; ComponentLink2Description: https://datasheet.ciiva.com/2553/pyu-r-int-thick-7-2553239.pdf?src-supplier=Digi-Key; ComponentLink3URL: https://datasheet.ciiva.com/16744/pyu-rc0402-51-rohs-l-6-r-16744999.pdf?src-supplier=Future+Electronics; ComponentLink3Description: https://datasheet.ciiva.com/16744/pyu-rc0402-51-rohs-l-6-r-16744999.pdf?src-supplier=Future+Electronics; ComponentLink4URL: https://datasheet.ciiva.com/2553/pyu-r-int-thick-7-2553240.pdf?src-supplier=Digi-Key; ComponentLink4Description: https://datasheet.ciiva.com/2553/pyu-r-int-thick-7-2553240.pdf?src-supplier=Digi-Key; ComponentLink5URL: https://datasheet.ciiva.com/2553/pyu-r-int-thick-7-2553241.pdf?src-supplier=Digi-Key; ComponentLink5Description: https://datasheet.ciiva.com/2553/pyu-r-int-thick-7-2553241.pdf?src-supplier=Digi-Key; ComponentLink6URL: https://datasheet.ciiva.com/7850/1018594-7850091.pdf?src-supplier=Element14; ComponentLink6Description: https://datasheet.ciiva.com/7850/1018594-7850091.pdf?src-supplier=Element14; ComponentLink7URL: https://datasheet.ciiva.com/12666/pyu-rc0402-51-rohs-l-6-r-12666987.pdf?src-supplier=Mouser; ComponentLink7Description: https://datasheet.ciiva.com/12666/pyu-rc0402-51-rohs-l-6-r-12666987.pdf?src-supplier=Mouser; ComponentLink8URL: https://datasheet.ciiva.com/7850/1018594-7850092.pdf?src-supplier=Element14; ComponentLink8Description: https://datasheet.ciiva.com/7850/1018594-7850092.pdf?src-supplier=Element14
R?#153 = RC0402FR-078K87L: Resistor 8.87kOhm 0402 SMD; Manufacturer: Yageo; Resistance: 8.87kR; Tolerance: 1%; Temperature Coefficient: 100ppm/°C; Power Rating: 62.5mW; Voltage Rating: 50V; Supplier 1: Digi-Key; Manufacturer Part Number: RC0402FR-078K87L; Stock 1: 839334; Pricing 1: 1=0.10000, 10=0.01600, 100=0.00670, 1000=0.00301, 2500=0.00261, 5000=0.00215 (USD); RoHS: Yes; Case/Package: 0402; Contact Plating: Tin,Matte; Case Code (Imperial): 0402; Case Code (Metric): 1005; Min Operating Temperature: -55°C; Max Operating Temperature: 155°C; Composition: Thick Film; Packaging: Tape and Reel; Termination: SMD/SMT; Military Standard: Not; Voltage Rating (DC): 50V; Working Voltage: 50V; Number of Terminations: 2; Length: 1mm; Height: 0.35mm; Width: 0.5mm; Depth: 0.5mm; Lead Free: Lead Free; ComponentLink1URL: https://datasheet.ciiva.com/16743/pyu-rc0402-51-rohs-l-6-r-16743879.pdf?src-supplier=Future+Electronics; ComponentLink1Description: https://datasheet.ciiva.com/16743/pyu-rc0402-51-rohs-l-6-r-16743879.pdf?src-supplier=Future+Electronics; ComponentLink2URL: https://datasheet.ciiva.com/12575/pyu-rc0402-51-rohs-l-6-r-8721-12575212.pdf?src-supplier=Mouser; ComponentLink2Description: https://datasheet.ciiva.com/12575/pyu-rc0402-51-rohs-l-6-r-8721-12575212.pdf?src-supplier=Mouser; ComponentLink3URL: https://datasheet.ciiva.com/16857/pyu-rc0402-51-rohs-l-6-16857900.pdf?src-supplier=Avnet+Europe; ComponentLink3Description: https://datasheet.ciiva.com/16857/pyu-rc0402-51-rohs-l-6-16857900.pdf?src-supplier=Avnet+Europe
R?#154 = RC0402FR-07150KL: Resistor 150kOhm 0402 SMD; Manufacturer: Yageo; Power Rating: 62.5mW; Tolerance: 1%; Temperature Coefficient: 100ppm/°C; Resistance: 150kR; Voltage Rating: 50V; Max Power Dissipation: 63mW; Supplier 1: Digi-Key; Manufacturer Part Number: RC0402FR-07150KL; Stock 1: 4029837; Pricing 1: 1=0.10000, 10=0.01600, 100=0.00670, 1000=0.00301, 2500=0.00261, 5000=0.00215 (USD); RoHS: Yes; Case/Package: 0402; Number of Pins: 2; Case Code (Metric): 1005; Case Code (Imperial): 0402; Min Operating Temperature: -55°C; Max Operating Temperature: 155°C; Package Quantity: 1; Packaging: Tape and Reel; Voltage Rating (DC): 50V; Composition: Thick Film; Number of Terminations: 2; Termination: SMD/SMT; Military Standard: Not; Working Voltage: 50V; Features: Moisture Resistant; Length: 1mm; Height: 0.016inch; Depth: 0.5mm; Width: 0.5mm; REACH SVHC: No SVHC; Lead Free: Lead Free; ComponentLink1URL: https://datasheet.ciiva.com/2453/pyu-r-int-thick-7-2453601.pdf?src-supplier=Digi-Key; ComponentLink1Description: https://datasheet.ciiva.com/2453/pyu-r-int-thick-7-2453601.pdf?src-supplier=Digi-Key; ComponentLink2URL: https://datasheet.ciiva.com/2453/pyu-r-int-thick-7-2453602.pdf?src-supplier=Digi-Key; ComponentLink2Description: https://datasheet.ciiva.com/2453/pyu-r-int-thick-7-2453602.pdf?src-supplier=Digi-Key; ComponentLink3URL: https://datasheet.ciiva.com/2453/pyu-r-int-thick-7-2453603.pdf?src-supplier=Digi-Key; ComponentLink3Description: https://datasheet.ciiva.com/2453/pyu-r-int-thick-7-2453603.pdf?src-supplier=Digi-Key; ComponentLink4URL: https://datasheet.ciiva.com/7983/1018594-7983494.pdf?src-supplier=Element14; ComponentLink4Description: https://datasheet.ciiva.com/7983/1018594-7983494.pdf?src-supplier=Element14; ComponentLink5URL: https://datasheet.ciiva.com/16741/pyu-rc0402-51-rohs-l-6-r-16741080.pdf?src-supplier=Future+Electronics; ComponentLink5Description: https://datasheet.ciiva.com/16741/pyu-rc0402-51-rohs-l-6-r-16741080.pdf?src-supplier=Future+Electronics; ComponentLink6URL: https://datasheet.ciiva.com/6067/1686128-6067913.pdf?src-supplier=Farnell; ComponentLink6Description: https://datasheet.ciiva.com/6067/1686128-6067913.pdf?src-supplier=Farnell; ComponentLink7URL: https://datasheet.ciiva.com/7849/1018594-7849836.pdf?src-supplier=Element14; ComponentLink7Description: https://datasheet.ciiva.com/7849/1018594-7849836.pdf?src-supplier=Element14; ComponentLink8URL: https://datasheet.ciiva.com/15189/getdatasheetpartid-326416-15189356.pdf?src-supplier=Verical; ComponentLink8Description: https://datasheet.ciiva.com/15189/getdatasheetpartid-326416-15189356.pdf?src-supplier=Verical; ComponentLink9URL: https://datasheet.ciiva.com/7849/1018594-7849837.pdf?src-supplier=Element14; ComponentLink9Description: https://datasheet.ciiva.com/7849/1018594-7849837.pdf?src-supplier=Element14
R?#155 = RC0402FR-0710K2L: Resistor 10.2kOhm 0402 SMD; Manufacturer: Yageo; Resistance: 10.2kR; Tolerance: 1%; Temperature Coefficient: 100ppm/°C; Power Rating: 62.5mW; Voltage Rating: 50V; Max Power Dissipation: 63mW; Supplier 1: Digi-Key; Manufacturer Part Number: RC0402FR-0710K2L; Stock 1: 702674; Pricing 1: 1=0.10000, 10=0.01600, 100=0.00670, 1000=0.00301, 2500=0.00261, 5000=0.00215 (USD); RoHS: Yes; Case/Package: 0402; Contact Plating: Tin,Matte,Lead; Case Code (Imperial): 0402; Case Code (Metric): 1005; Min Operating Temperature: -55°C; Max Operating Temperature: 155°C; Composition: Thick Film; Packaging: Tape and Reel; Number of Terminations: 2; Termination: SMD/SMT; Military Standard: Not; Voltage Rating (DC): 50V; Working Voltage: 50V; Features: Moisture Resistant; Length: 1mm; Height: 0.016inch; Width: 0.02inch; Depth: 0.5mm; Radiation Hardening: No; Lead Free: Lead Free; ComponentLink1URL: https://datasheet.ciiva.com/26829/getdatasheetpartid-327827-26829879.pdf?src-supplier=Verical; ComponentLink1Description: https://datasheet.ciiva.com/26829/getdatasheetpartid-327827-26829879.pdf?src-supplier=Verical; ComponentLink2URL: https://datasheet.ciiva.com/28405/pyu-rc0402-51-rohs-l-6-28405453.pdf?src-supplier=Avnet+Europe; ComponentLink2Description: https://datasheet.ciiva.com/28405/pyu-rc0402-51-rohs-l-6-28405453.pdf?src-supplier=Avnet+Europe; ComponentLink3URL: https://datasheet.ciiva.com/8891/pyu-rc0402-51-rohs-l-6-8891272.pdf?src-supplier=Avnet; ComponentLink3Description: https://datasheet.ciiva.com/8891/pyu-rc0402-51-rohs-l-6-8891272.pdf?src-supplier=Avnet; ComponentLink4URL: https://datasheet.ciiva.com/16740/pyu-rc0402-51-rohs-l-6-r-16740766.pdf?src-supplier=Future+Electronics; ComponentLink4Description: https://datasheet.ciiva.com/16740/pyu-rc0402-51-rohs-l-6-r-16740766.pdf?src-supplier=Future+Electronics

## Sheet Power_Regulation2.SchDoc
size A